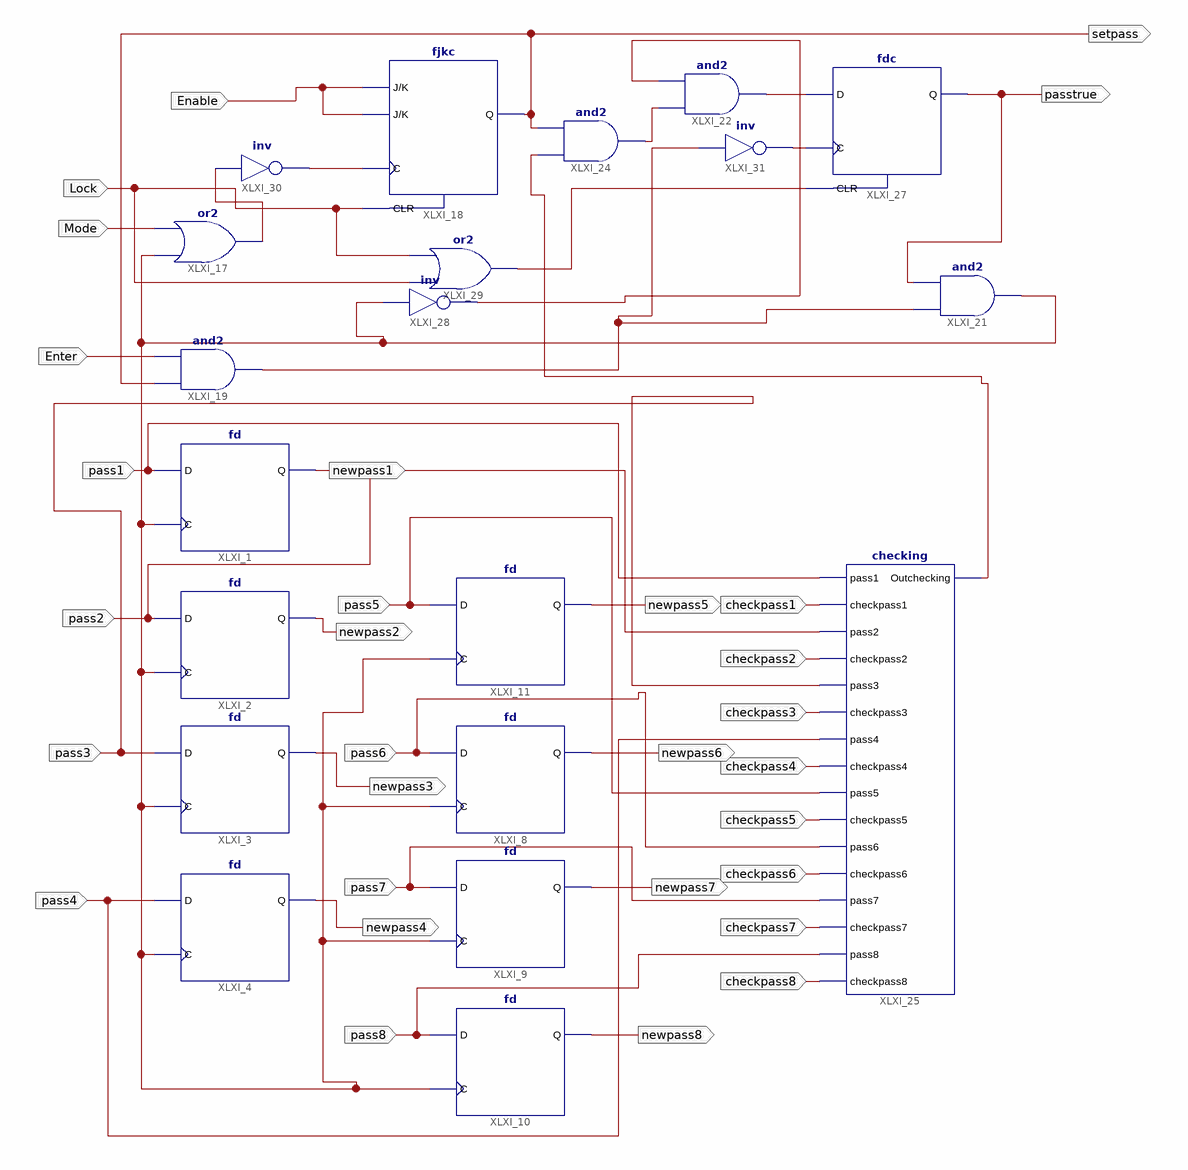
[diagram p0: schematic sheet 1]
// Xilinx ISE schematic setpass.sch (spartan6) as structural Verilog: 20 symbols, 30 ports
module setpass (
  input  pass1,
  input  pass2,
  input  pass5,
  input  pass6,
  input  pass7,
  input  pass8,
  input  Mode,
  input  Enable,
  input  Enter,
  input  pass3,
  input  pass4,
  input  checkpass1,
  input  checkpass2,
  input  checkpass3,
  input  checkpass4,
  input  checkpass5,
  input  checkpass6,
  input  checkpass7,
  input  checkpass8,
  input  Lock,
  output setpass,
  output passtrue,
  output newpass2,
  output newpass3,
  output newpass4,
  output newpass5,
  output newpass6,
  output newpass7,
  output newpass8,
  output newpass1
);

  wire XLXN_21, XLXN_30, XLXN_64, XLXN_65, XLXN_66, XLXN_67, XLXN_68, XLXN_83, XLXN_87, XLXN_88;

  fd XLXI_1 (.C(XLXN_66), .D(pass1), .Q(newpass1));
  fd XLXI_2 (.C(XLXN_66), .D(pass2), .Q(newpass2));
  fd XLXI_3 (.C(XLXN_66), .D(pass3), .Q(newpass3));
  fd XLXI_4 (.C(XLXN_66), .D(pass4), .Q(newpass4));
  fd XLXI_8 (.C(XLXN_66), .D(pass6), .Q(newpass6));
  fd XLXI_9 (.C(XLXN_66), .D(pass7), .Q(newpass7));
  fd XLXI_10 (.C(XLXN_66), .D(pass8), .Q(newpass8));
  fd XLXI_11 (.C(XLXN_66), .D(pass5), .Q(newpass5));
  or XLXI_17 (XLXN_87, XLXN_66, Mode);
  fjkc XLXI_18 (.C(XLXN_21), .CLR(Lock), .J(Enable), .K(Enable), .Q(setpass));
  and XLXI_19 (XLXN_30, setpass, Enter);
  and XLXI_21 (XLXN_66, XLXN_30, passtrue);
  and XLXI_22 (XLXN_68, XLXN_65, XLXN_67);
  and XLXI_24 (XLXN_65, XLXN_64, setpass);
  checking XLXI_25 (
    .checkpass1(checkpass1), .checkpass2(checkpass2), .checkpass3(checkpass3), .checkpass4(checkpass4),
    .checkpass5(checkpass5), .checkpass6(checkpass6), .checkpass7(checkpass7), .checkpass8(checkpass8),
    .Outchecking(XLXN_64), .pass1(pass1), .pass2(pass2), .pass3(pass3), .pass4(pass4), .pass5(pass5),
    .pass6(pass6), .pass7(pass7), .pass8(pass8));
  fdc XLXI_27 (.C(XLXN_88), .CLR(XLXN_83), .D(XLXN_68), .Q(passtrue));
  not XLXI_28 (XLXN_67, XLXN_66);
  or XLXI_29 (XLXN_83, Lock, Lock);
  not XLXI_30 (XLXN_21, XLXN_87);
  not XLXI_31 (XLXN_88, XLXN_30);
endmodule
